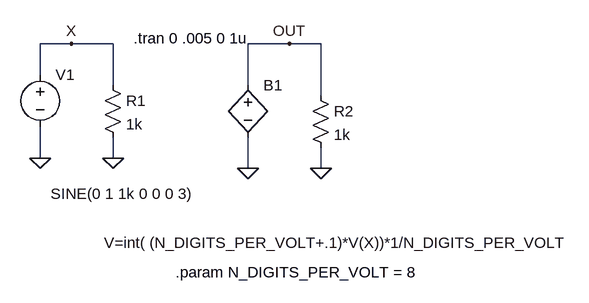
[diagram p0: schematic quantizer.asc]
quantizer.asc, the LTspice schematic file:
Version 4
SHEET 1 1036 680
WIRE 48 48 0 48
WIRE 112 48 48 48
WIRE 384 48 320 48
WIRE 432 48 384 48
WIRE 0 96 0 48
WIRE 112 112 112 48
WIRE 320 112 320 48
WIRE 432 128 432 48
WIRE 0 224 0 176
WIRE 112 224 112 192
WIRE 320 240 320 192
WIRE 432 240 432 208
FLAG 0 224 0
FLAG 320 240 0
FLAG 112 224 0
FLAG 432 240 0
FLAG 48 48 X
FLAG 384 48 OUT
SYMBOL bv 320 96 R0
WINDOW 3 -222 258 Left 2
SYMATTR Value V=int( (N_DIGITS_PER_VOLT+.1)*V(X))*1/N_DIGITS_PER_VOLT
SYMATTR InstName B1
SYMBOL voltage 0 80 R0
WINDOW 3 16 199 Left 2
WINDOW 123 0 0 Left 2
WINDOW 39 0 0 Left 2
SYMATTR Value SINE(0 1 1k 0 0 0 3)
SYMATTR InstName V1
SYMBOL res 96 96 R0
SYMATTR InstName R1
SYMATTR Value 1k
SYMBOL res 416 112 R0
SYMATTR InstName R2
SYMATTR Value 1k
TEXT 144 40 Left 2 !.tran 0 .005 0 1u
TEXT 208 400 Left 2 !.param N_DIGITS_PER_VOLT = 8

The netlist it stands for:
* quantizer.asc
B1 OUT 0 V=int( (N_DIGITS_PER_VOLT+.1)*V(X))*1/N_DIGITS_PER_VOLT
V1 X 0 SINE(0 1 1k 0 0 0 3)
R1 X 0 1k
R2 OUT 0 1k
.tran 0 .005 0 1u
.param N_DIGITS_PER_VOLT = 8
.backanno
.end